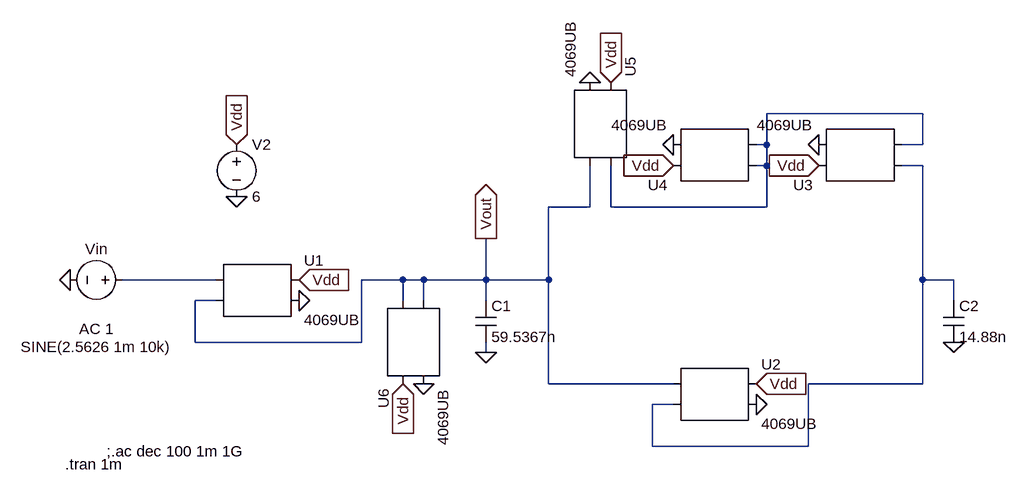
[diagram p0: schematic gm_C_filter.asc]
gm_C_filter.asc, the LTspice schematic file:
Version 4
SHEET 1 880 916
WIRE 640 -64 400 -64
WIRE 400 -16 400 -64
WIRE 400 -16 384 -16
WIRE 640 -16 640 -64
WIRE 640 -16 608 -16
WIRE 400 16 400 -16
WIRE 400 16 384 16
WIRE 640 16 608 16
WIRE 128 80 128 16
WIRE 128 80 64 80
WIRE 160 80 160 16
WIRE 400 80 400 16
WIRE 400 80 160 80
WIRE -448 192 -592 192
WIRE -160 192 -224 192
WIRE -128 192 -160 192
WIRE -32 192 -32 128
WIRE -32 192 -128 192
WIRE 64 192 64 80
WIRE 64 192 -32 192
WIRE 640 192 640 16
WIRE 688 192 640 192
WIRE -448 224 -480 224
WIRE -160 224 -160 192
WIRE -128 224 -128 192
WIRE -32 224 -32 192
WIRE 688 224 688 192
WIRE -480 288 -480 224
WIRE -224 288 -224 192
WIRE -224 288 -480 288
WIRE -32 304 -32 288
WIRE 64 352 64 192
WIRE 256 352 64 352
WIRE 640 352 640 192
WIRE 640 352 464 352
WIRE 256 384 224 384
WIRE 224 448 224 384
WIRE 464 448 464 352
WIRE 464 448 224 448
FLAG -416 64 0
FLAG -416 -16 Vdd
IOPIN -416 -16 In
FLAG -672 192 0
FLAG -320 192 Vdd
IOPIN -320 192 In
FLAG -320 224 0
FLAG -32 304 0
FLAG 384 352 Vdd
IOPIN 384 352 In
FLAG 384 384 0
FLAG 688 288 0
FLAG -32 128 Vout
IOPIN -32 128 Out
FLAG 256 16 Vdd
IOPIN 256 16 In
FLAG 480 16 Vdd
IOPIN 480 16 In
FLAG 480 -16 0
FLAG 256 -16 0
FLAG 128 -112 0
FLAG 160 -112 Vdd
IOPIN 160 -112 In
FLAG -160 352 Vdd
IOPIN -160 352 In
FLAG -128 352 0
SYMBOL voltage -416 -32 R0
WINDOW 123 0 0 Left 0
WINDOW 39 0 0 Left 0
SYMATTR InstName V2
SYMATTR Value 6
SYMBOL AutoGenerated\\4069UB -384 208 R0
SYMATTR InstName U1
SYMBOL voltage -576 192 R90
WINDOW 0 -32 56 VBottom 2
WINDOW 3 88 56 VTop 2
WINDOW 123 60 56 VTop 2
WINDOW 39 0 0 Left 0
SYMATTR InstName Vin
SYMATTR Value SINE(2.5626 1m 10k)
SYMATTR Value2 AC 1
SYMBOL cap -48 224 R0
SYMATTR InstName C1
SYMATTR Value 59.5367n
SYMBOL AutoGenerated\\4069UB 320 368 R0
SYMATTR InstName U2
SYMBOL cap 672 224 R0
SYMATTR InstName C2
SYMATTR Value 14.88n
SYMBOL AutoGenerated\\4069UB 544 0 R180
SYMATTR InstName U3
SYMBOL AutoGenerated\\4069UB 320 0 R180
SYMATTR InstName U4
SYMBOL AutoGenerated\\4069UB 144 -48 M270
SYMATTR InstName U5
SYMBOL AutoGenerated\\4069UB -144 288 M90
SYMATTR InstName U6
TEXT -616 456 Left 2 !;.ac dec 100 1m 1G
TEXT -680 476 Left 2 !.tran 1m

The netlist it stands for:
* gm_C_filter.asc
V2 Vdd 0 6
* U1: 4069UB (symbol AutoGenerated\4069UB not available, pins judged from their places): pin1=N003 pin2=Vout pin3=Vdd pin4=0
Vin N003 0 SINE(2.5626 1m 10k) AC 1
C1 Vout 0 59.5367n
* U2: 4069UB (symbol AutoGenerated\4069UB not available, pins judged from their places): pin1=Vout pin2=N002 pin3=Vdd pin4=0
C2 N002 0 14.88n
* U3: 4069UB (symbol AutoGenerated\4069UB not available, pins judged from their places): pin1=N002 pin2=N001 pin3=Vdd pin4=0
* U4: 4069UB (symbol AutoGenerated\4069UB not available, pins judged from their places): pin1=N001 pin2=N001 pin3=Vdd pin4=0
* U5: 4069UB (symbol AutoGenerated\4069UB not available, pins judged from their places): pin1=N001 pin2=Vout pin3=Vdd pin4=0
* U6: 4069UB (symbol AutoGenerated\4069UB not available, pins judged from their places): pin1=Vout pin2=Vout pin3=Vdd pin4=0
;.ac dec 100 1m 1G
.tran 1m
.backanno
.end